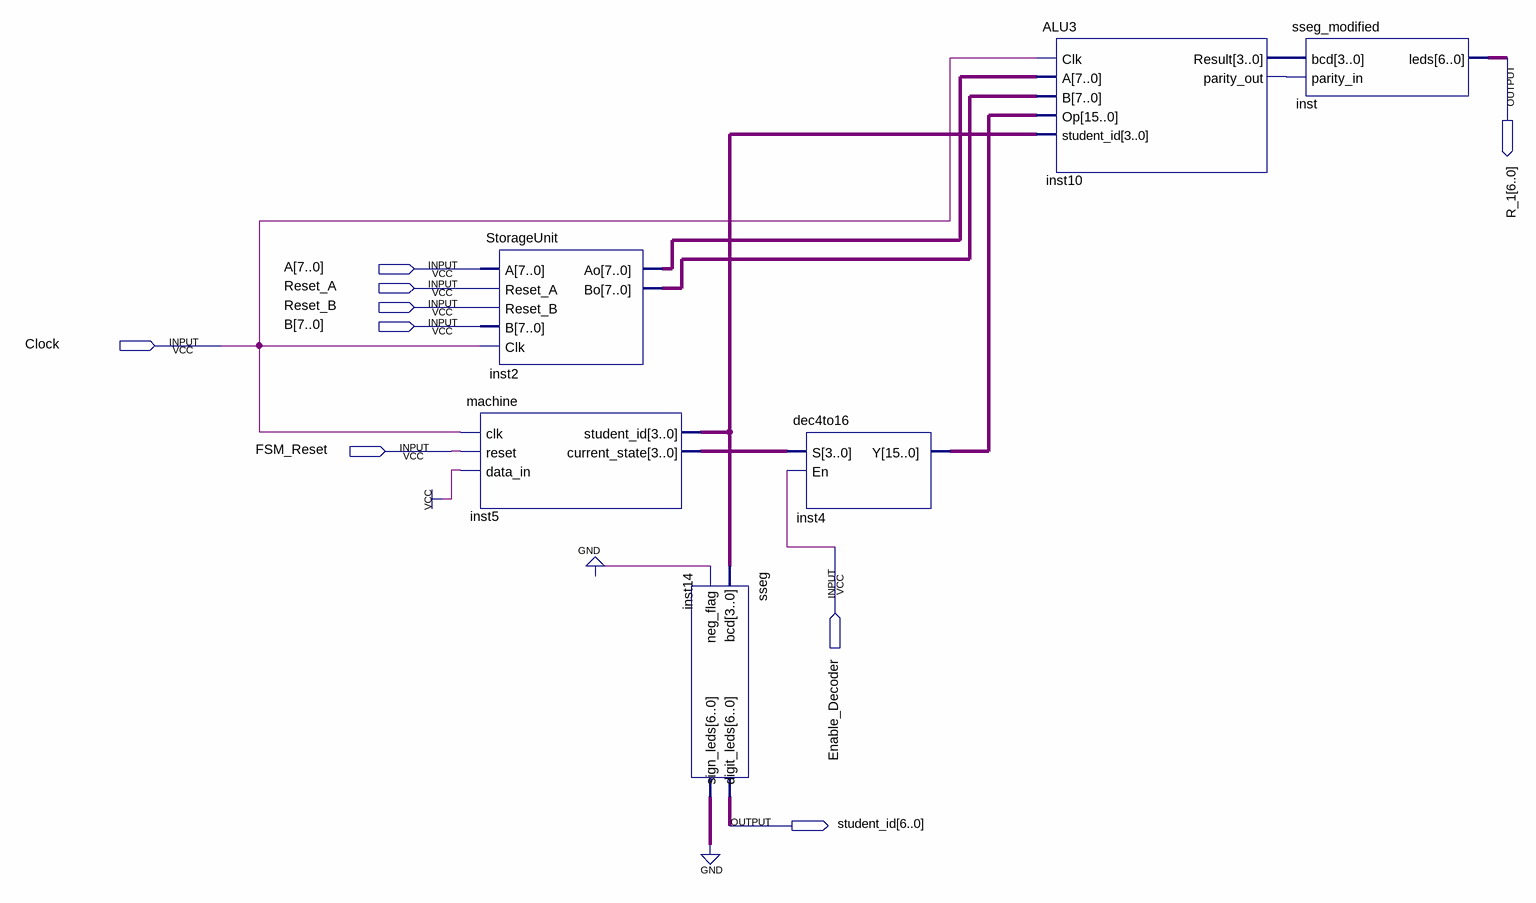
[diagram p0: schematic sheet]
// Quartus schematic lab6_part3_d.bdf as structural Verilog: 6 symbols, 9 pins
module lab6_part3_d (
  input  [7:0] A,
  input  Reset_A,
  input  Reset_B,
  input  [7:0] B,
  input  Clock,
  input  FSM_Reset,
  input  Enable_Decoder,
  output [6:0] R_1,
  output [6:0] student_id
);

  wire inst10_parity_out;
  wire [3:0] inst5_current_state, inst5_student_id, inst10_result;
  wire [6:0] inst14_sign_leds;
  wire [7:0] inst2_ao, inst2_bo;
  wire [15:0] inst4_y;

  StorageUnit inst2 (.A(A), .Reset_A(Reset_A), .Reset_B(Reset_B), .B(B), .Clk(Clock), .Ao(inst2_ao), .Bo(inst2_bo));
  machine inst5 (
    .clk(Clock), .reset(FSM_Reset), .data_in(1'b1), .student_id(inst5_student_id),
    .current_state(inst5_current_state));
  sseg inst14 (.bcd(inst5_student_id), .neg_flag(1'b0), .digit_leds(student_id), .sign_leds(inst14_sign_leds));
  dec4to16 inst4 (.S(inst5_current_state), .En(Enable_Decoder), .Y(inst4_y));
  ALU3 inst10 (
    .Clk(Clock), .A(inst2_ao), .B(inst2_bo), .Op(inst4_y), .student_id(inst5_student_id),
    .Result(inst10_result), .parity_out(inst10_parity_out));
  sseg_modified inst (.bcd(inst10_result), .parity_in(inst10_parity_out), .leds(R_1));
  // also tied to GND on the sheet: {inst14_sign_leds[0], inst14_sign_leds[1], inst14_sign_leds[2], inst14_sign_leds[3], inst14_sign_leds[4], inst14_sign_leds[5], inst14_sign_leds[6]}
endmodule
